# EasyEDA Pro project 圆环探针板.eprj

# Schematic 原理图
Board Name: 探针; Create Date: 2024-04-22; Page Name: 主控MCU; Project Name: 探针圆盘; Schematic Name: 原理图; Update Date: 2025-06-17; Company: 嘉立创EDA; Page Size: A3; Version: V1.0
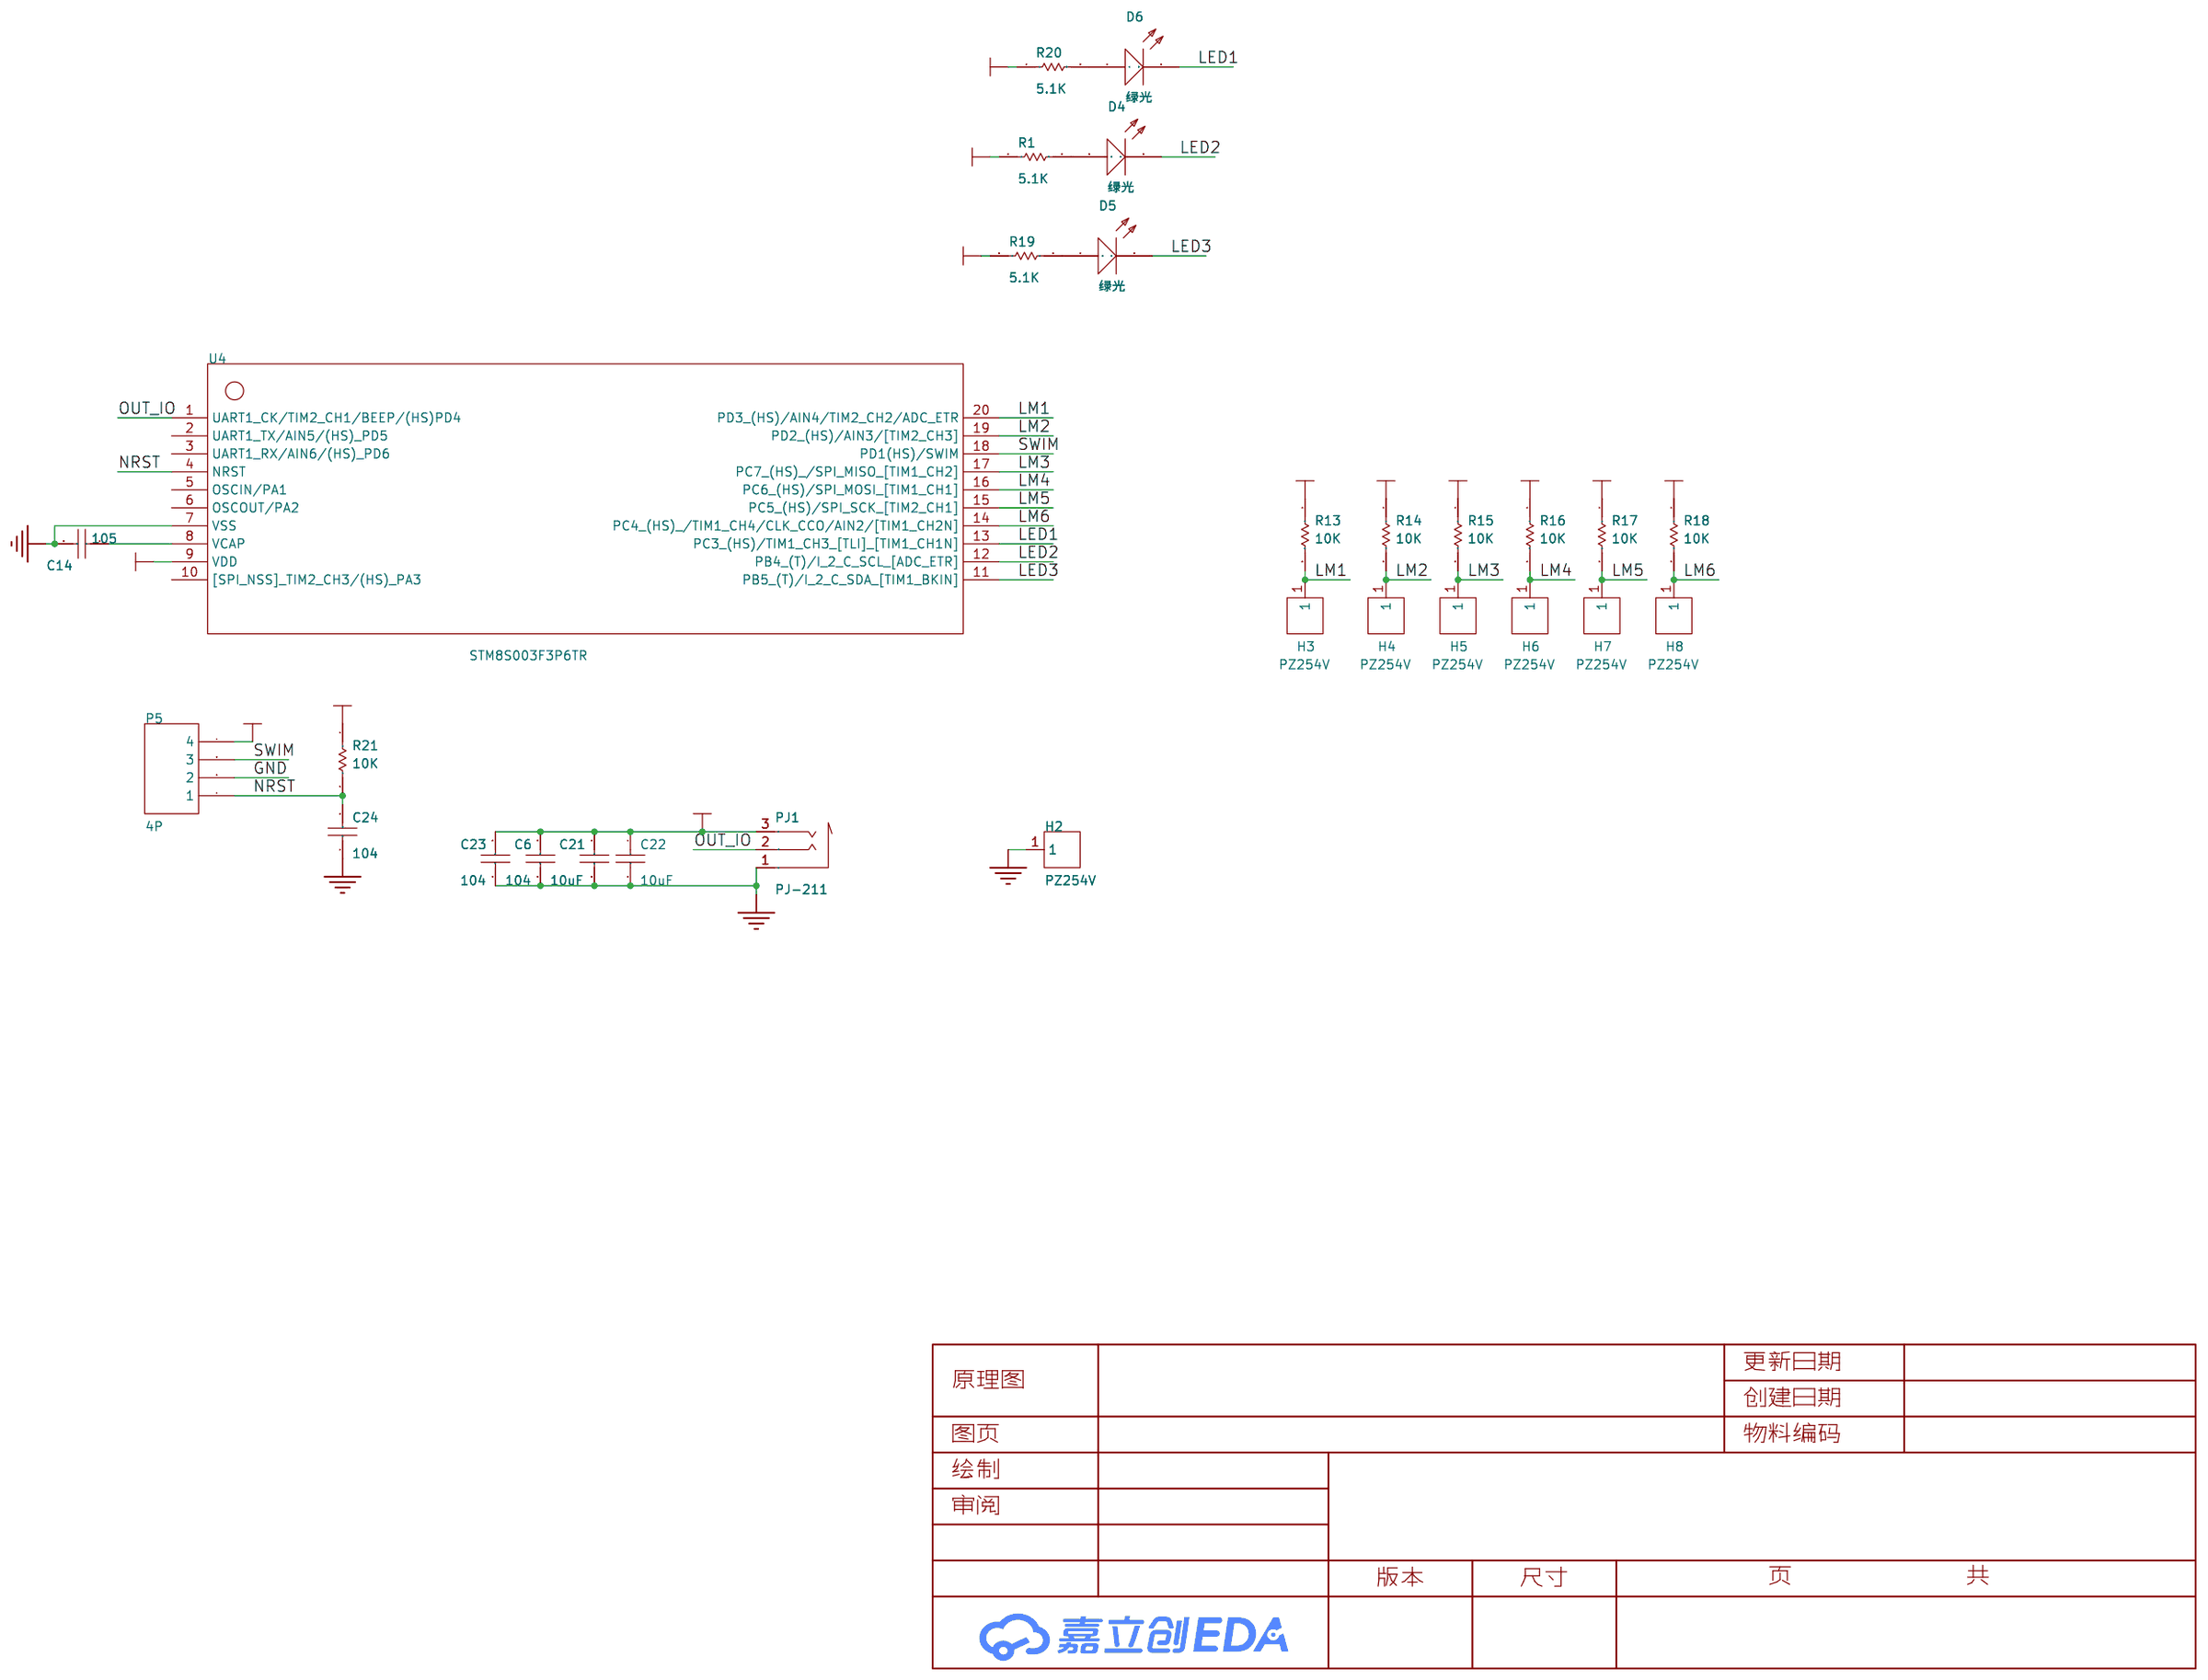
[diagram p0: schematic sheet]

## Parts
C6  104  [0603C]
C14  105  [0603C]
C21  10uF  [C1206]
C22  10uF  [C1206]
C23  104  [0603C]
C24  104  [0603C]
D4  绿光  [0603LED]
D5  绿光  [0603LED]
D6  绿光  [0603LED]
H2  PZ254V  [HDR-TH_1P-PZ254V-11-01P-YL]
H3  PZ254V  [HDR-TH_1P-PZ254V-11-01P-YL]
H4  PZ254V  [HDR-TH_1P-PZ254V-11-01P-YL]
H5  PZ254V  [HDR-TH_1P-PZ254V-11-01P-YL]
H6  PZ254V  [HDR-TH_1P-PZ254V-11-01P-YL]
H7  PZ254V  [HDR-TH_1P-PZ254V-11-01P-YL]
H8  PZ254V  [HDR-TH_1P-PZ254V-11-01P-YL]
P5  4P  [SIP4]
PJ1  PJ-211  [AUDIO-TH_PJ-211]
R1  5.1K  [0603R]
R13  10K  [0603R]
R14  10K  [0603R]
R15  10K  [0603R]
R16  10K  [0603R]
R17  10K  [0603R]
R18  10K  [0603R]
R19  5.1K  [0603R]
R20  5.1K  [0603R]
R21  10K  [0603R]
U4  STM8S003F3P6TR  [TSSOP-20_L6.5-W4.4-P0.65-LS6.4-BL]

## Library data of the parts
C6 C23 C24 = 104: Capacitor (Semiconductor SIM Model); Published: 8-Jun-2000; LatestRevisionDate: 17-Jul-2002; LatestRevisionNote: Re-released for DXP Platform.; PackageReference: C1206; Publisher: Altium Limited; Origin Footprint 2: C1206; Origin Footprint 3: 0402; Origin Footprint 4: 1310[0504]; Origin Footprint 5: 1608[0603]; Origin Footprint 6: C1210; Origin Footprint 7: C0805; Origin Footprint 8: C1206; Origin Footprint 9: 0805; Origin Footprint 10: 0805L; Design Item ID: Cap Semi; Library Name: Miscellaneous Devices
C14 = 104: Capacitor (Semiconductor SIM Model); Published: 8-Jun-2000; LatestRevisionDate: 17-Jul-2002; LatestRevisionNote: Re-released for DXP Platform.; PackageReference: C1206; Publisher: Altium Limited; Origin Footprint 2: C1206; Origin Footprint 3: 0402; Origin Footprint 4: 1310[0504]; Origin Footprint 5: 1608[0603]; Origin Footprint 6: C1210; Origin Footprint 7: C0805; Origin Footprint 8: C1206; Origin Footprint 9: 0805; Origin Footprint 10: 0805L; Origin Footprint 11: 0805C; Design Item ID: Cap Semi; Library Name: Miscellaneous Devices
C21 C22 = 104: Design Item ID: CAP; Library Name: SCH--װ--
D4-D6 = 红光: Origin Footprint 2: LED(小); Design Item ID: LED; Library Name: SCH封装库
H2-H8 = PZ254V-11-01P-YL: Supplier Part: C41425304; Manufacturer: XFCN(兴飞); Supplier Footprint: 插件,P=2.54mm; Datasheet: https://atta.szlcsc.com/upload/public/pdf/source/20241009/C227763597A5D58F5275B212435FDB0D.pdf; Supplier: LCSC
P5 = 4P: Library Name: SCH--װ--
PJ1 = PJ-211: LCSC Part Name: 2.5mm耳机座; Supplier Part: C668603; Manufacturer: SHOU HAN(首韩); Supplier Footprint: 插件; JLCPCB Part Class: 扩展库; Datasheet: https://atta.szlcsc.com/upload/public/pdf/source/20240424/A9B1C075589DFCFC3B81D72D2B4C46E7.pdf; Supplier: LCSC; Connector Type: 2.5mm耳机座; Current Rating (Max): 500mA; Voltage Rating (Max): 30V; Contact Material: 铜; Contact Plating: 银; Operating Temperature Range: -30℃~+70℃
R1 R19 R20 = 2K: Resistor; Published: 8-Jun-2000; LatestRevisionDate: 17-Jul-2002; LatestRevisionNote: Re-released for DXP Platform.; PackageReference: AXIAL-0.3; Publisher: Altium Limited; Origin Footprint 2: AXIAL-0.3; Origin Footprint 3: R0805; Origin Footprint 4: 0805R; Design Item ID: RES; Library Name: SCH封装库
R13-R18 R21 = 10k: Resistor; Published: 8-Jun-2000; LatestRevisionDate: 17-Jul-2002; LatestRevisionNote: Re-released for DXP Platform.; PackageReference: AXIAL-0.3; Publisher: Altium Limited; Origin Footprint 2: AXIAL-0.3; Origin Footprint 3: R0805; Origin Footprint 4: 0805R; Design Item ID: RES; Library Name: SCH封装库
U4 = STM8S003F3P6TR: Supplier Part: C52717; Manufacturer: ST(意法半导体); Supplier Footprint: TSSOP-20; JLCPCB Part Class: Basic Part; Datasheet: https://atta.szlcsc.com/upload/public/pdf/source/20170914/C52717_1505374129400969196.pdf; Supplier: LCSC; Core Processor: STM8; Speed: 16MHz; Voltage - Supply (Vcc/Vdd): 2.95V~ 5.5V; Program Memory Size: 8KB; RAM Size: 1KB; EEPROM Size: 128Bytes; Number of I/O: 16; A/D: 5x10bit; PWM: 3; UART/USART: 1 USART

## Nets
5V: C6.2 C21.1 C22.1 C23.2 P5.4 PJ1.3 R1.1 R13.1 R14.1 R15.1 R16.1 R17.1 R18.1 R19.1 R20.1 R21.1 U4.9(VDD)
GND: C6.1 C14.2 C21.2 C22.2 C23.1 C24.1 H2.1 P5.2 PJ1.1 U4.7(VSS)
LED1: D6.2 U4.13(PC3 (HS)/TIM1_CH3 [TLI] [TIM1_CH1N])
LED2: D4.2 U4.12(PB4 (T)/I 2 C_SCL [ADC_ETR])
LED3: D5.2 U4.11(PB5 (T)/I 2 C_SDA [TIM1_BKIN])
LM1: H3.1 R13.2 U4.20(PD3 (HS)/AIN4/TIM2_CH2/ADC_ETR)
LM2: H4.1 R14.2 U4.19(PD2 (HS)/AIN3/[TIM2_CH3])
LM3: H5.1 R15.2 U4.17(PC7 (HS) /SPI_MISO [TIM1_CH2])
LM4: H6.1 R16.2 U4.16(PC6 (HS)/SPI_MOSI [TIM1_CH1])
LM5: H7.1 R17.2 U4.15(PC5 (HS)/SPI_SCK [TIM2_CH1])
LM6: H8.1 R18.2 U4.14(PC4 (HS) /TIM1_CH4/CLK_CCO/AIN2/[TIM1_CH2N])
NRST: C24.2 P5.1 R21.2 U4.4(NRST)
OUT_IO: PJ1.2 U4.1(UART1_CK/TIM2_CH1/BEEP/(HS)PD4)
SWIM: P5.3 U4.18(PD1(HS)/SWIM)
Net-(C14-1): C14.1 U4.8(VCAP)
Net-(D4-1): D4.1 R1.2
Net-(D5-1): D5.1 R19.2
Net-(D6-1): D6.1 R20.2

Not connected (* = marked no-connect by the designer): U4 2(UART1_TX/AIN5/(HS) PD5) 3(UART1_RX/AIN6/(HS) PD6) 5(OSCIN/PA1) 6(OSCOUT/PA2) 10([SPI_NSS] TIM2_CH3/(HS) PA3)

# Board PCB
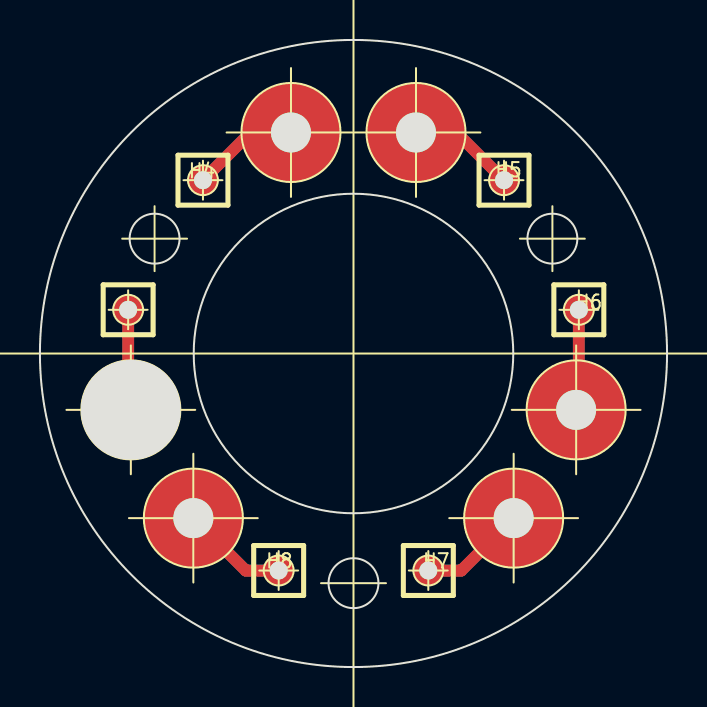
[diagram p1: board, top side]
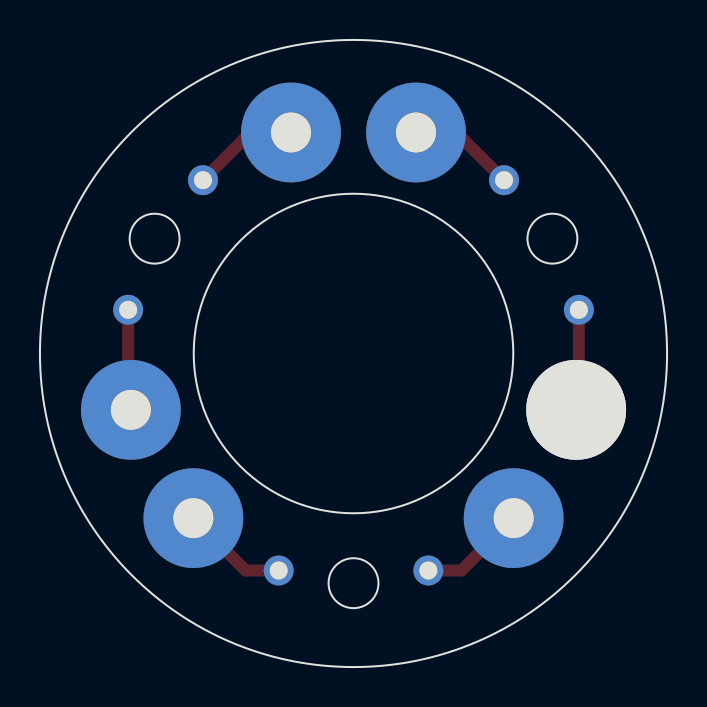
[diagram p2: board, bottom side, seen from below]

Outline 31.4 x 31.4 mm; copper layers: Top Layer, Bottom Layer. Coordinates in mm from the lower left corner of the outline.
Outline path: circle c5.74,21.45 r1.25 ; circle c15.7,15.7 r8 ; circle c15.7,15.7 r15.7 ; circle c15.7,4.2 r1.25 ; circle c25.66,21.45 r1.25
Stack: Top Layer 0.035mm / Dielectric1 1.51mm FR4 er 4.5 / Bottom Layer 0.035mm

## Design rules (mm)
template: 用户自定义配置
spacing Default (default): track to track 0.152, other pairs 0 to 0.152
track width Default (default): min 0.254, default 0.254, max 25.4
differential pair differentialPair (default): width min 0.127, default 0.254, max 2.54; gap min 0.152, default 0.152
via Default (default): diameter min 0.25, default 0.61, max 100.025; hole min 0.2, default 0.305, max 59.995

## Placement (name value [footprint] x y rotation side)
H3  PZ254V  [HDR-TH_1P-PZ254V-11-01P-YL]  4.42 17.89 0 top
H4  PZ254V  [HDR-TH_1P-PZ254V-11-01P-YL]  8.16 24.38 0 top
H5  PZ254V  [HDR-TH_1P-PZ254V-11-01P-YL]  23.24 24.38 0 top
H6  PZ254V  [HDR-TH_1P-PZ254V-11-01P-YL]  26.98 17.89 0 top
H7  PZ254V  [HDR-TH_1P-PZ254V-11-01P-YL]  19.45 4.83 0 top
H8  PZ254V  [HDR-TH_1P-PZ254V-11-01P-YL]  11.95 4.83 0 top
NOREF  -  [Pad_ie333]  18.83 26.77 180 top
NOREF#2  -  [Pad_ie334]  12.57 26.77 180 top
NOREF#3  -  [Pad_ie272]  23.72 7.46 180 top
NOREF#4  -  [Pad_ie271]  7.68 7.46 180 top
NOREF#5  -  [Pad_ie273]  26.85 12.88 180 top
NOREF#6  -  [Pad_ie270]  4.55 12.88 180 top

## Footprints (pads in the part's own frame, mm; a bottom-side part is the same pattern mirrored in y, then rotated)
HDR-TH_1P-PZ254V-11-01P-YL
  round 1.5 hole 0.9: 1(0,0)
Pad_ie270
  round 5 hole 5x2: 0(0,0)
Pad_ie271
  round 5 hole 2: 0(0,0)
Pad_ie272
  round 5 hole 2: 0(0,0)
Pad_ie273
  round 5 hole 2: 0(0,0)
Pad_ie333
  round 5 hole 2: 0(0,0)
Pad_ie334
  round 5 hole 2: 0(0,0)

## Nets
LM1: H3.1 NOREF#6.0
LM2: H4.1 NOREF#2.0
LM3: H5.1 NOREF.0
LM4: H6.1 NOREF#5.0
LM5: H7.1 NOREF#3.0
LM6: H8.1 NOREF#4.0

## Routing (per net, layer and track width the routed paths; a pad name or vN(x,y) marks a point on that pad's centre or on a via; arc(x,y) is an arc through that point)
LM1: length 5.1
  Top Layer w0.6: NOREF#6.0 4.42,13.01 H3.1
LM2: length 5.4
  Top Layer w0.6: NOREF#2.0 10.55,26.77 H4.1
LM3: length 5.4
  Top Layer w0.6: NOREF.0 20.85,26.77 H5.1
LM4: length 5.1
  Top Layer w0.6: H6.1 26.98,13.01 NOREF#5.0
LM5: length 5.4
  Top Layer w0.6: H7.1 21.1,4.83 NOREF#3.0
LM6: length 5.4
  Top Layer w0.6: NOREF#4.0 10.3,4.83 H8.1
